# Altium schematic sheet 2020-04-02-04-30101 - ETC_Interface_Circuit_2.SchDoc
size A4
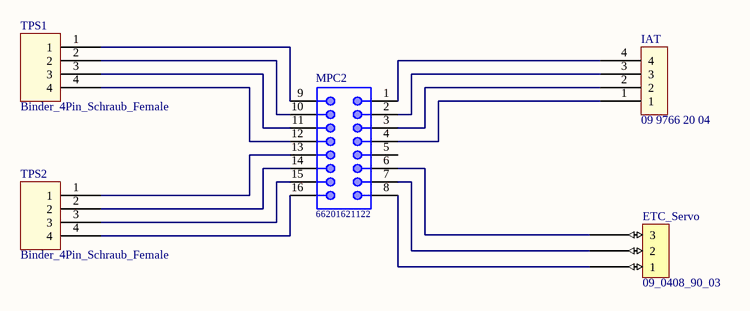
[diagram p0: 2020-04-02-04-30101 - ETC_Interface_Circuit_2.SchDoc]

## Parts
ETC_Servo  09_0408_90_03  [09_0408_90_03]
IAT  09 9766 20 04  [09 9766 20 04]
MPC2  66201621122  [66201621122]
TPS1  Binder_4Pin_Schraub_Female  [09 0412 30 04]
TPS2  Binder_4Pin_Schraub_Female  [09 0412 30 04]

## Nets
NetETC_Servo_1: ETC_Servo.1 MPC2.8
NetETC_Servo_2: ETC_Servo.2 MPC2.7
NetETC_Servo_3: ETC_Servo.3 MPC2.6
NetIAT_1: IAT.1 MPC2.4
NetIAT_2: IAT.2 MPC2.3
NetIAT_3: IAT.3 MPC2.2
NetIAT_4: IAT.4 MPC2.1
NetMPC2_9: MPC2.9 TPS1.1
NetMPC2_10: MPC2.10 TPS1.2
NetMPC2_11: MPC2.11 TPS1.3
NetMPC2_12: MPC2.12 TPS1.4
NetMPC2_13: MPC2.13 TPS2.1
NetMPC2_14: MPC2.14 TPS2.2
NetMPC2_15: MPC2.15 TPS2.3
NetMPC2_16: MPC2.16 TPS2.4

Not connected (* = marked no-connect by the designer): MPC2 5

## Library data of the parts
IAT = 09 9766 20 04: Binder 4 Pin Female SnapIn
MPC2 = 66201621122: THT Male Header WR-MPC3, Vertical, Dual Row, pitch 3 mm, 16 pins; Pitch: 3 mm; Working Voltage: 250 VAC; Contact Resistance: 10 mOhm; Pin Number: 16; ComponentLink1Description: Manufacturer; ComponentLink1URL: http://www.we-online.de; ComponentLink2Description: Datasheet; ComponentLink2URL: https://katalog.we-online.de/em/datasheet/6620xx21122.pdf; Part Number: 66201621122; Published Date: September 2018; Publisher: Wurth Elektronik; Operating Temperature: -40 to 105 degC; Packaging: Tube; Gender: Male; Mounting Technology: THT; Orientation: Vertical